# EAGLE schematic LEDSubMatrixHighDensity_temp (EAGLE 9.6.2)
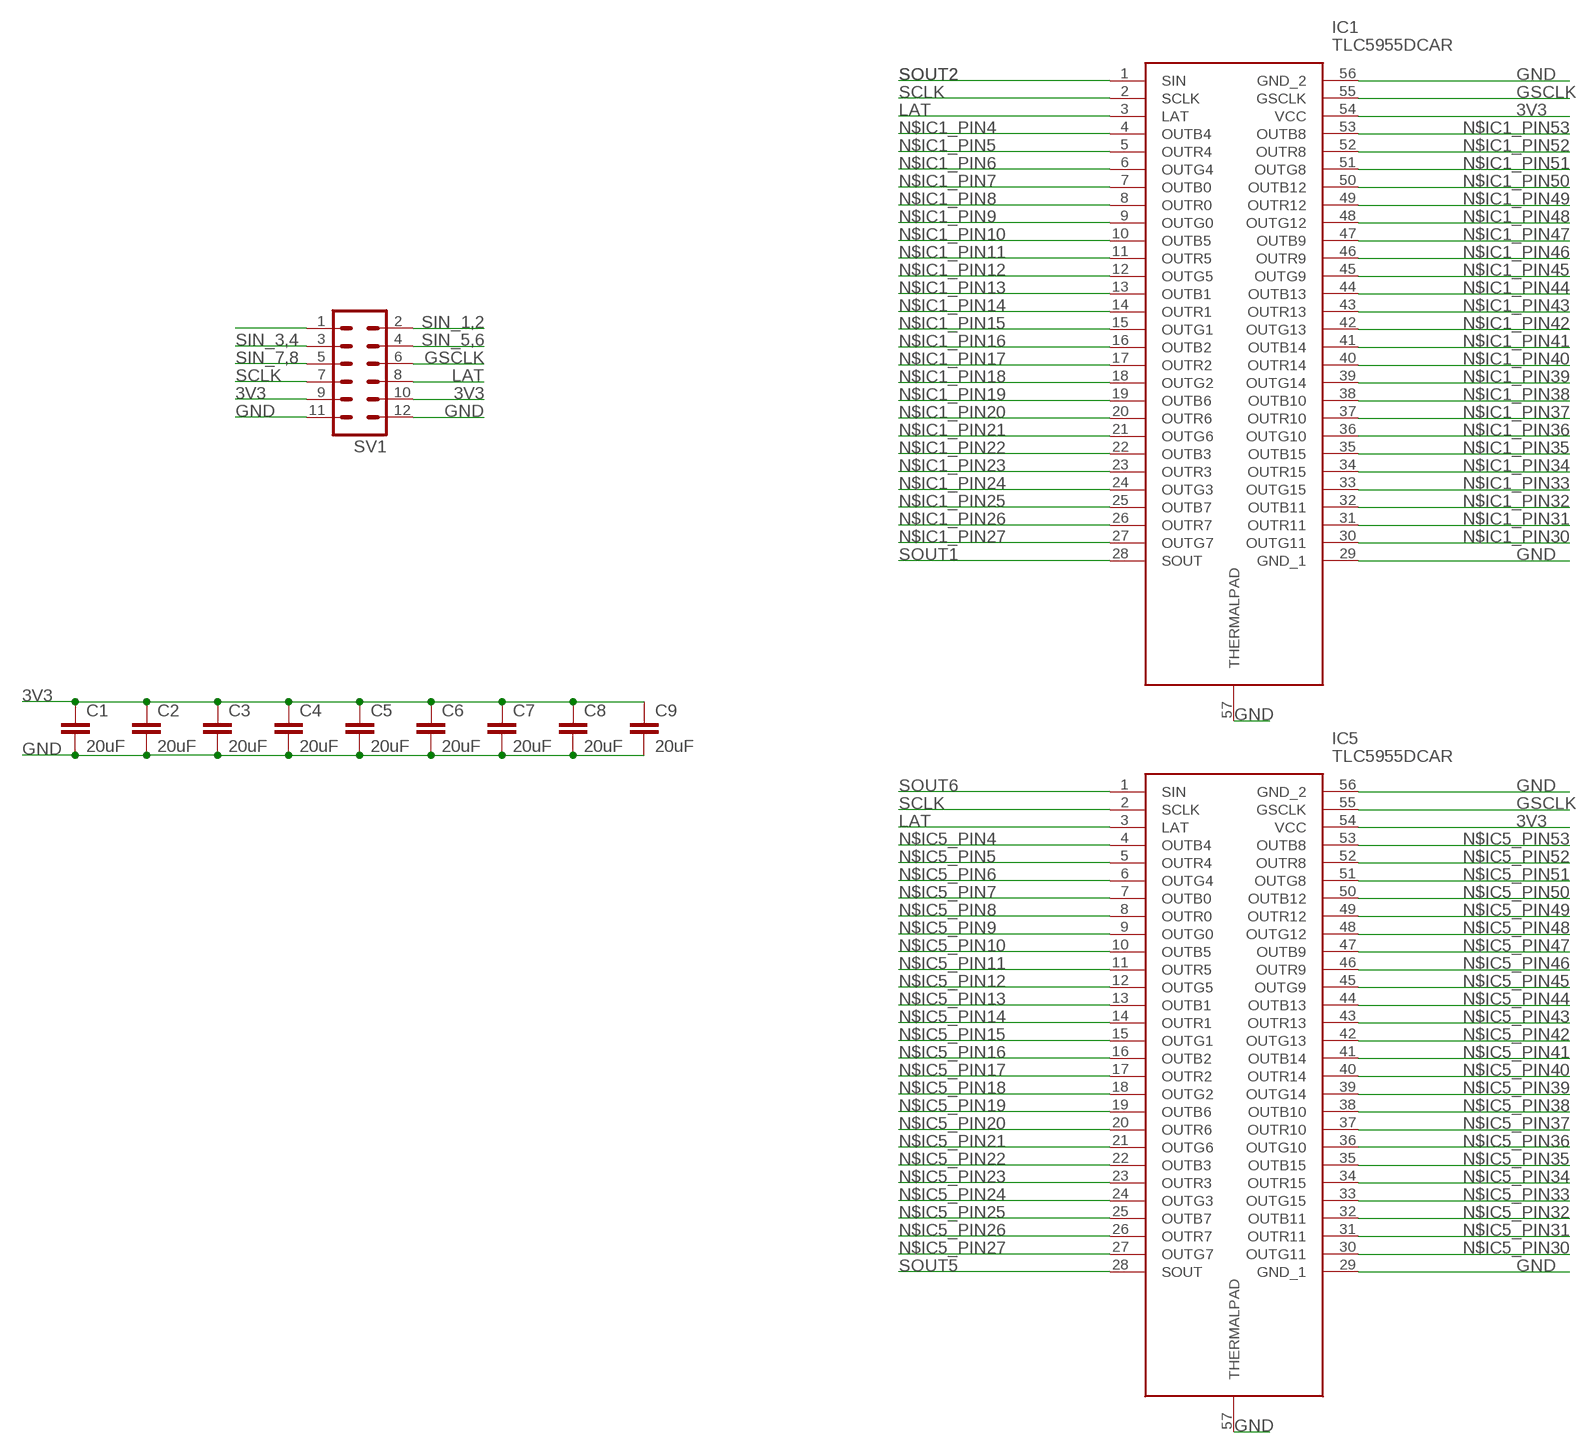
[diagram p0: schematic, sheet 1, part 1 of 2]
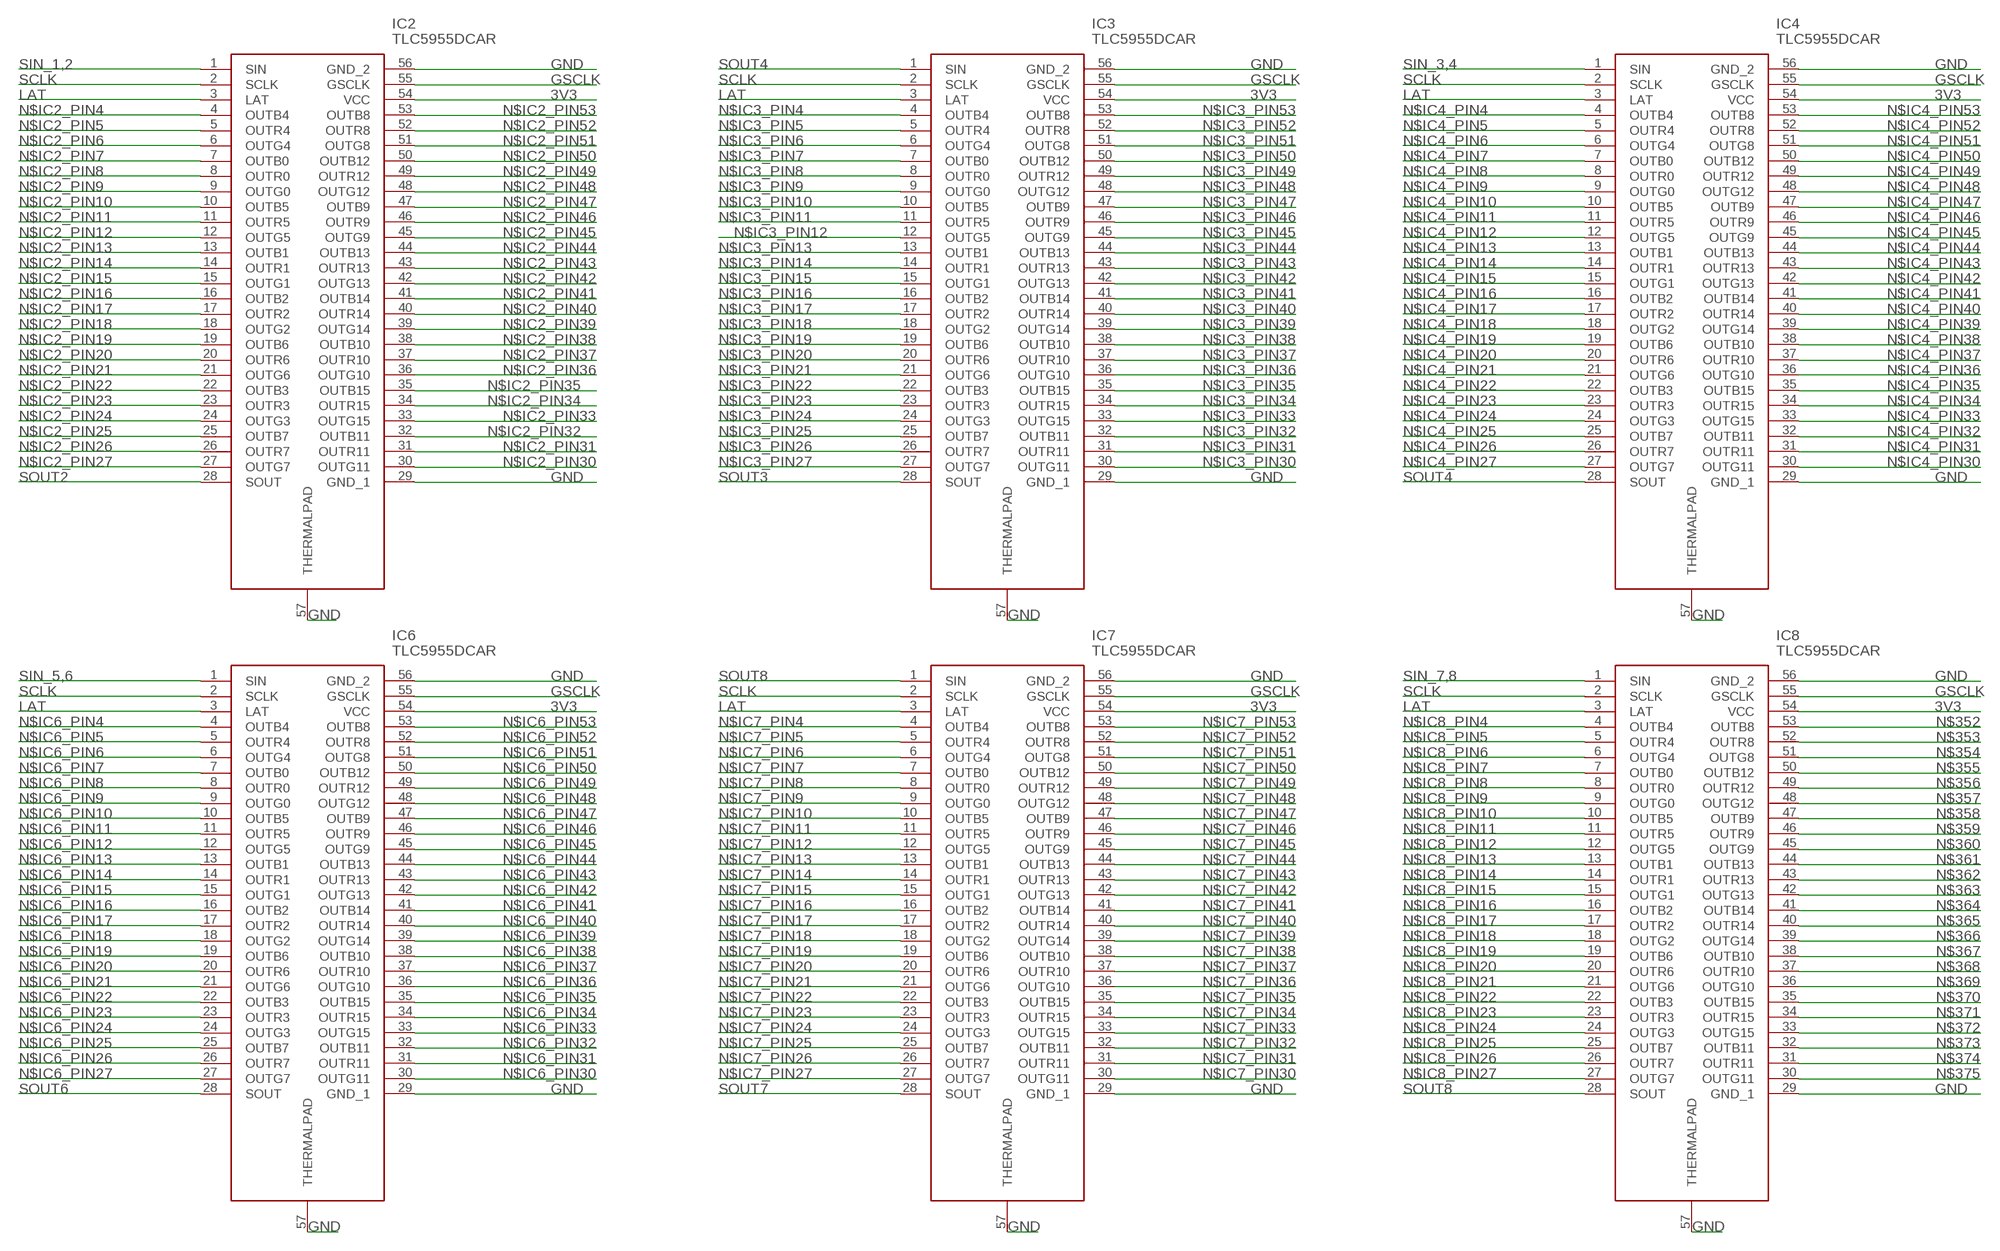
[diagram p1: schematic, sheet 1, part 2 of 2]

## Parts
C1  20uF  C-EUC0603  [C0603]
C2  20uF  C-EUC0603  [C0603]
C3  20uF  C-EUC0603  [C0603]
C4  20uF  C-EUC0603  [C0603]
C5  20uF  C-EUC0603  [C0603]
C6  20uF  C-EUC0603  [C0603]
C7  20uF  C-EUC0603  [C0603]
C8  20uF  C-EUC0603  [C0603]
C9  20uF  C-EUC0805  [C0805]
IC1  TLC5955DCAR  [SOP50P810X120-57N]
IC2  TLC5955DCAR  [SOP50P810X120-57N]
IC3  TLC5955DCAR  [SOP50P810X120-57N]
IC4  TLC5955DCAR  [SOP50P810X120-57N]
IC5  TLC5955DCAR  [SOP50P810X120-57N]
IC6  TLC5955DCAR  [SOP50P810X120-57N]
IC7  TLC5955DCAR  [SOP50P810X120-57N]
IC8  TLC5955DCAR  [SOP50P810X120-57N]
SV1  MA06-2  [MA06-2]

## Nets
3V3: C1.1 C2.1 C3.1 C4.1 C5.1 C6.1 C7.1 C8.1 C9.1 IC1.54(VCC) IC2.54(VCC) IC3.54(VCC) IC4.54(VCC) IC5.54(VCC) IC6.54(VCC) IC7.54(VCC) IC8.54(VCC) SV1.9 SV1.10
GND: C1.2 C2.2 C3.2 C4.2 C5.2 C6.2 C7.2 C8.2 C9.2 IC1.29(GND_1) IC1.56(GND_2) IC1.57(THERMALPAD) IC2.29(GND_1) IC2.56(GND_2) IC2.57(THERMALPAD) IC3.29(GND_1) IC3.56(GND_2) IC3.57(THERMALPAD) IC4.29(GND_1) IC4.56(GND_2) IC4.57(THERMALPAD) IC5.29(GND_1) IC5.56(GND_2) IC5.57(THERMALPAD) IC6.29(GND_1) IC6.56(GND_2) IC6.57(THERMALPAD) IC7.29(GND_1) IC7.56(GND_2) IC7.57(THERMALPAD) IC8.29(GND_1) IC8.56(GND_2) IC8.57(THERMALPAD) SV1.11 SV1.12
GSCLK: IC1.55(GSCLK) IC2.55(GSCLK) IC3.55(GSCLK) IC4.55(GSCLK) IC5.55(GSCLK) IC6.55(GSCLK) IC7.55(GSCLK) IC8.55(GSCLK) SV1.6
LAT: IC1.3(LAT) IC2.3(LAT) IC3.3(LAT) IC4.3(LAT) IC5.3(LAT) IC6.3(LAT) IC7.3(LAT) IC8.3(LAT) SV1.8
N$1: SV1.1
N$352: IC8.53(OUTB8)
N$353: IC8.52(OUTR8)
N$354: IC8.51(OUTG8)
N$355: IC8.50(OUTB12)
N$356: IC8.49(OUTR12)
N$357: IC8.48(OUTG12)
N$358: IC8.47(OUTB9)
N$359: IC8.46(OUTR9)
N$360: IC8.45(OUTG9)
N$361: IC8.44(OUTB13)
N$362: IC8.43(OUTR13)
N$363: IC8.42(OUTG13)
N$364: IC8.41(OUTB14)
N$365: IC8.40(OUTR14)
N$366: IC8.39(OUTG14)
N$367: IC8.38(OUTB10)
N$368: IC8.37(OUTR10)
N$369: IC8.36(OUTG10)
N$370: IC8.35(OUTB15)
N$371: IC8.34(OUTR15)
N$372: IC8.33(OUTG15)
N$373: IC8.32(OUTB11)
N$374: IC8.31(OUTR11)
N$375: IC8.30(OUTG11)
N$IC1_PIN4: IC1.4(OUTB4)
N$IC1_PIN5: IC1.5(OUTR4)
N$IC1_PIN6: IC1.6(OUTG4)
N$IC1_PIN7: IC1.7(OUTB0)
N$IC1_PIN8: IC1.8(OUTR0)
N$IC1_PIN9: IC1.9(OUTG0)
N$IC1_PIN10: IC1.10(OUTB5)
N$IC1_PIN11: IC1.11(OUTR5)
N$IC1_PIN12: IC1.12(OUTG5)
N$IC1_PIN13: IC1.13(OUTB1)
N$IC1_PIN14: IC1.14(OUTR1)
N$IC1_PIN15: IC1.15(OUTG1)
N$IC1_PIN16: IC1.16(OUTB2)
N$IC1_PIN17: IC1.17(OUTR2)
N$IC1_PIN18: IC1.18(OUTG2)
N$IC1_PIN19: IC1.19(OUTB6)
N$IC1_PIN20: IC1.20(OUTR6)
N$IC1_PIN21: IC1.21(OUTG6)
N$IC1_PIN22: IC1.22(OUTB3)
N$IC1_PIN23: IC1.23(OUTR3)
N$IC1_PIN24: IC1.24(OUTG3)
N$IC1_PIN25: IC1.25(OUTB7)
N$IC1_PIN26: IC1.26(OUTR7)
N$IC1_PIN27: IC1.27(OUTG7)
N$IC1_PIN30: IC1.30(OUTG11)
N$IC1_PIN31: IC1.31(OUTR11)
N$IC1_PIN32: IC1.32(OUTB11)
N$IC1_PIN33: IC1.33(OUTG15)
N$IC1_PIN34: IC1.34(OUTR15)
N$IC1_PIN35: IC1.35(OUTB15)
N$IC1_PIN36: IC1.36(OUTG10)
N$IC1_PIN37: IC1.37(OUTR10)
N$IC1_PIN38: IC1.38(OUTB10)
N$IC1_PIN39: IC1.39(OUTG14)
N$IC1_PIN40: IC1.40(OUTR14)
N$IC1_PIN41: IC1.41(OUTB14)
N$IC1_PIN42: IC1.42(OUTG13)
N$IC1_PIN43: IC1.43(OUTR13)
N$IC1_PIN44: IC1.44(OUTB13)
N$IC1_PIN45: IC1.45(OUTG9)
N$IC1_PIN46: IC1.46(OUTR9)
N$IC1_PIN47: IC1.47(OUTB9)
N$IC1_PIN48: IC1.48(OUTG12)
N$IC1_PIN49: IC1.49(OUTR12)
N$IC1_PIN50: IC1.50(OUTB12)
N$IC1_PIN51: IC1.51(OUTG8)
N$IC1_PIN52: IC1.52(OUTR8)
N$IC1_PIN53: IC1.53(OUTB8)
N$IC2_PIN4: IC2.4(OUTB4)
N$IC2_PIN5: IC2.5(OUTR4)
N$IC2_PIN6: IC2.6(OUTG4)
N$IC2_PIN7: IC2.7(OUTB0)
N$IC2_PIN8: IC2.8(OUTR0)
N$IC2_PIN9: IC2.9(OUTG0)
N$IC2_PIN10: IC2.10(OUTB5)
N$IC2_PIN11: IC2.11(OUTR5)
N$IC2_PIN12: IC2.12(OUTG5)
N$IC2_PIN13: IC2.13(OUTB1)
N$IC2_PIN14: IC2.14(OUTR1)
N$IC2_PIN15: IC2.15(OUTG1)
N$IC2_PIN16: IC2.16(OUTB2)
N$IC2_PIN17: IC2.17(OUTR2)
N$IC2_PIN18: IC2.18(OUTG2)
N$IC2_PIN19: IC2.19(OUTB6)
N$IC2_PIN20: IC2.20(OUTR6)
N$IC2_PIN21: IC2.21(OUTG6)
N$IC2_PIN22: IC2.22(OUTB3)
N$IC2_PIN23: IC2.23(OUTR3)
N$IC2_PIN24: IC2.24(OUTG3)
N$IC2_PIN25: IC2.25(OUTB7)
N$IC2_PIN26: IC2.26(OUTR7)
N$IC2_PIN27: IC2.27(OUTG7)
N$IC2_PIN30: IC2.30(OUTG11)
N$IC2_PIN31: IC2.31(OUTR11)
N$IC2_PIN32: IC2.32(OUTB11)
N$IC2_PIN33: IC2.33(OUTG15)
N$IC2_PIN34: IC2.34(OUTR15)
N$IC2_PIN35: IC2.35(OUTB15)
N$IC2_PIN36: IC2.36(OUTG10)
N$IC2_PIN37: IC2.37(OUTR10)
N$IC2_PIN38: IC2.38(OUTB10)
N$IC2_PIN39: IC2.39(OUTG14)
N$IC2_PIN40: IC2.40(OUTR14)
N$IC2_PIN41: IC2.41(OUTB14)
N$IC2_PIN42: IC2.42(OUTG13)
N$IC2_PIN43: IC2.43(OUTR13)
N$IC2_PIN44: IC2.44(OUTB13)
N$IC2_PIN45: IC2.45(OUTG9)
N$IC2_PIN46: IC2.46(OUTR9)
N$IC2_PIN47: IC2.47(OUTB9)
N$IC2_PIN48: IC2.48(OUTG12)
N$IC2_PIN49: IC2.49(OUTR12)
N$IC2_PIN50: IC2.50(OUTB12)
N$IC2_PIN51: IC2.51(OUTG8)
N$IC2_PIN52: IC2.52(OUTR8)
N$IC2_PIN53: IC2.53(OUTB8)
N$IC3_PIN4: IC3.4(OUTB4)
N$IC3_PIN5: IC3.5(OUTR4)
N$IC3_PIN6: IC3.6(OUTG4)
N$IC3_PIN7: IC3.7(OUTB0)
N$IC3_PIN8: IC3.8(OUTR0)
N$IC3_PIN9: IC3.9(OUTG0)
N$IC3_PIN10: IC3.10(OUTB5)
N$IC3_PIN11: IC3.11(OUTR5)
N$IC3_PIN12: IC3.12(OUTG5)
N$IC3_PIN13: IC3.13(OUTB1)
N$IC3_PIN14: IC3.14(OUTR1)
N$IC3_PIN15: IC3.15(OUTG1)
N$IC3_PIN16: IC3.16(OUTB2)
N$IC3_PIN17: IC3.17(OUTR2)
N$IC3_PIN18: IC3.18(OUTG2)
N$IC3_PIN19: IC3.19(OUTB6)
N$IC3_PIN20: IC3.20(OUTR6)
N$IC3_PIN21: IC3.21(OUTG6)
N$IC3_PIN22: IC3.22(OUTB3)
N$IC3_PIN23: IC3.23(OUTR3)
N$IC3_PIN24: IC3.24(OUTG3)
N$IC3_PIN25: IC3.25(OUTB7)
N$IC3_PIN26: IC3.26(OUTR7)
N$IC3_PIN27: IC3.27(OUTG7)
N$IC3_PIN30: IC3.30(OUTG11)
N$IC3_PIN31: IC3.31(OUTR11)
N$IC3_PIN32: IC3.32(OUTB11)
N$IC3_PIN33: IC3.33(OUTG15)
N$IC3_PIN34: IC3.34(OUTR15)
N$IC3_PIN35: IC3.35(OUTB15)
N$IC3_PIN36: IC3.36(OUTG10)
N$IC3_PIN37: IC3.37(OUTR10)
N$IC3_PIN38: IC3.38(OUTB10)
N$IC3_PIN39: IC3.39(OUTG14)
N$IC3_PIN40: IC3.40(OUTR14)
N$IC3_PIN41: IC3.41(OUTB14)
N$IC3_PIN42: IC3.42(OUTG13)
N$IC3_PIN43: IC3.43(OUTR13)
N$IC3_PIN44: IC3.44(OUTB13)
N$IC3_PIN45: IC3.45(OUTG9)
N$IC3_PIN46: IC3.46(OUTR9)
N$IC3_PIN47: IC3.47(OUTB9)
N$IC3_PIN48: IC3.48(OUTG12)
N$IC3_PIN49: IC3.49(OUTR12)
N$IC3_PIN50: IC3.50(OUTB12)
N$IC3_PIN51: IC3.51(OUTG8)
N$IC3_PIN52: IC3.52(OUTR8)
N$IC3_PIN53: IC3.53(OUTB8)
N$IC4_PIN4: IC4.4(OUTB4)
N$IC4_PIN5: IC4.5(OUTR4)
N$IC4_PIN6: IC4.6(OUTG4)
N$IC4_PIN7: IC4.7(OUTB0)
N$IC4_PIN8: IC4.8(OUTR0)
N$IC4_PIN9: IC4.9(OUTG0)
N$IC4_PIN10: IC4.10(OUTB5)
N$IC4_PIN11: IC4.11(OUTR5)
N$IC4_PIN12: IC4.12(OUTG5)
N$IC4_PIN13: IC4.13(OUTB1)
N$IC4_PIN14: IC4.14(OUTR1)
N$IC4_PIN15: IC4.15(OUTG1)
N$IC4_PIN16: IC4.16(OUTB2)
N$IC4_PIN17: IC4.17(OUTR2)
N$IC4_PIN18: IC4.18(OUTG2)
N$IC4_PIN19: IC4.19(OUTB6)
N$IC4_PIN20: IC4.20(OUTR6)
N$IC4_PIN21: IC4.21(OUTG6)
N$IC4_PIN22: IC4.22(OUTB3)
N$IC4_PIN23: IC4.23(OUTR3)
N$IC4_PIN24: IC4.24(OUTG3)
N$IC4_PIN25: IC4.25(OUTB7)
N$IC4_PIN26: IC4.26(OUTR7)
N$IC4_PIN27: IC4.27(OUTG7)
N$IC4_PIN30: IC4.30(OUTG11)
N$IC4_PIN31: IC4.31(OUTR11)
N$IC4_PIN32: IC4.32(OUTB11)
N$IC4_PIN33: IC4.33(OUTG15)
N$IC4_PIN34: IC4.34(OUTR15)
N$IC4_PIN35: IC4.35(OUTB15)
N$IC4_PIN36: IC4.36(OUTG10)
N$IC4_PIN37: IC4.37(OUTR10)
N$IC4_PIN38: IC4.38(OUTB10)
N$IC4_PIN39: IC4.39(OUTG14)
N$IC4_PIN40: IC4.40(OUTR14)
N$IC4_PIN41: IC4.41(OUTB14)
N$IC4_PIN42: IC4.42(OUTG13)
N$IC4_PIN43: IC4.43(OUTR13)
N$IC4_PIN44: IC4.44(OUTB13)
N$IC4_PIN45: IC4.45(OUTG9)
N$IC4_PIN46: IC4.46(OUTR9)
N$IC4_PIN47: IC4.47(OUTB9)
N$IC4_PIN48: IC4.48(OUTG12)
N$IC4_PIN49: IC4.49(OUTR12)
N$IC4_PIN50: IC4.50(OUTB12)
N$IC4_PIN51: IC4.51(OUTG8)
N$IC4_PIN52: IC4.52(OUTR8)
N$IC4_PIN53: IC4.53(OUTB8)
N$IC5_PIN4: IC5.4(OUTB4)
N$IC5_PIN5: IC5.5(OUTR4)
N$IC5_PIN6: IC5.6(OUTG4)
N$IC5_PIN7: IC5.7(OUTB0)
N$IC5_PIN8: IC5.8(OUTR0)
N$IC5_PIN9: IC5.9(OUTG0)
N$IC5_PIN10: IC5.10(OUTB5)
N$IC5_PIN11: IC5.11(OUTR5)
N$IC5_PIN12: IC5.12(OUTG5)
N$IC5_PIN13: IC5.13(OUTB1)
N$IC5_PIN14: IC5.14(OUTR1)
N$IC5_PIN15: IC5.15(OUTG1)
N$IC5_PIN16: IC5.16(OUTB2)
N$IC5_PIN17: IC5.17(OUTR2)
N$IC5_PIN18: IC5.18(OUTG2)
N$IC5_PIN19: IC5.19(OUTB6)
N$IC5_PIN20: IC5.20(OUTR6)
N$IC5_PIN21: IC5.21(OUTG6)
N$IC5_PIN22: IC5.22(OUTB3)
N$IC5_PIN23: IC5.23(OUTR3)
N$IC5_PIN24: IC5.24(OUTG3)
N$IC5_PIN25: IC5.25(OUTB7)
N$IC5_PIN26: IC5.26(OUTR7)
N$IC5_PIN27: IC5.27(OUTG7)
N$IC5_PIN30: IC5.30(OUTG11)
N$IC5_PIN31: IC5.31(OUTR11)
N$IC5_PIN32: IC5.32(OUTB11)
N$IC5_PIN33: IC5.33(OUTG15)
N$IC5_PIN34: IC5.34(OUTR15)
N$IC5_PIN35: IC5.35(OUTB15)
N$IC5_PIN36: IC5.36(OUTG10)
N$IC5_PIN37: IC5.37(OUTR10)
N$IC5_PIN38: IC5.38(OUTB10)
N$IC5_PIN39: IC5.39(OUTG14)
N$IC5_PIN40: IC5.40(OUTR14)
N$IC5_PIN41: IC5.41(OUTB14)
N$IC5_PIN42: IC5.42(OUTG13)
N$IC5_PIN43: IC5.43(OUTR13)
N$IC5_PIN44: IC5.44(OUTB13)
N$IC5_PIN45: IC5.45(OUTG9)
N$IC5_PIN46: IC5.46(OUTR9)
N$IC5_PIN47: IC5.47(OUTB9)
N$IC5_PIN48: IC5.48(OUTG12)
N$IC5_PIN49: IC5.49(OUTR12)
N$IC5_PIN50: IC5.50(OUTB12)
N$IC5_PIN51: IC5.51(OUTG8)
N$IC5_PIN52: IC5.52(OUTR8)
N$IC5_PIN53: IC5.53(OUTB8)
N$IC6_PIN4: IC6.4(OUTB4)
N$IC6_PIN5: IC6.5(OUTR4)
N$IC6_PIN6: IC6.6(OUTG4)
N$IC6_PIN7: IC6.7(OUTB0)
N$IC6_PIN8: IC6.8(OUTR0)
N$IC6_PIN9: IC6.9(OUTG0)
N$IC6_PIN10: IC6.10(OUTB5)
N$IC6_PIN11: IC6.11(OUTR5)
N$IC6_PIN12: IC6.12(OUTG5)
N$IC6_PIN13: IC6.13(OUTB1)
N$IC6_PIN14: IC6.14(OUTR1)
N$IC6_PIN15: IC6.15(OUTG1)
N$IC6_PIN16: IC6.16(OUTB2)
N$IC6_PIN17: IC6.17(OUTR2)
N$IC6_PIN18: IC6.18(OUTG2)
N$IC6_PIN19: IC6.19(OUTB6)
N$IC6_PIN20: IC6.20(OUTR6)
N$IC6_PIN21: IC6.21(OUTG6)
N$IC6_PIN22: IC6.22(OUTB3)
N$IC6_PIN23: IC6.23(OUTR3)
N$IC6_PIN24: IC6.24(OUTG3)
N$IC6_PIN25: IC6.25(OUTB7)
N$IC6_PIN26: IC6.26(OUTR7)
N$IC6_PIN27: IC6.27(OUTG7)
N$IC6_PIN30: IC6.30(OUTG11)
N$IC6_PIN31: IC6.31(OUTR11)
N$IC6_PIN32: IC6.32(OUTB11)
N$IC6_PIN33: IC6.33(OUTG15)
N$IC6_PIN34: IC6.34(OUTR15)
N$IC6_PIN35: IC6.35(OUTB15)
N$IC6_PIN36: IC6.36(OUTG10)
N$IC6_PIN37: IC6.37(OUTR10)
N$IC6_PIN38: IC6.38(OUTB10)
N$IC6_PIN39: IC6.39(OUTG14)
N$IC6_PIN40: IC6.40(OUTR14)
N$IC6_PIN41: IC6.41(OUTB14)
N$IC6_PIN42: IC6.42(OUTG13)
N$IC6_PIN43: IC6.43(OUTR13)
N$IC6_PIN44: IC6.44(OUTB13)
N$IC6_PIN45: IC6.45(OUTG9)
N$IC6_PIN46: IC6.46(OUTR9)
N$IC6_PIN47: IC6.47(OUTB9)
N$IC6_PIN48: IC6.48(OUTG12)
N$IC6_PIN49: IC6.49(OUTR12)
N$IC6_PIN50: IC6.50(OUTB12)
N$IC6_PIN51: IC6.51(OUTG8)
N$IC6_PIN52: IC6.52(OUTR8)
N$IC6_PIN53: IC6.53(OUTB8)
N$IC7_PIN4: IC7.4(OUTB4)
N$IC7_PIN5: IC7.5(OUTR4)
N$IC7_PIN6: IC7.6(OUTG4)
N$IC7_PIN7: IC7.7(OUTB0)
N$IC7_PIN8: IC7.8(OUTR0)
N$IC7_PIN9: IC7.9(OUTG0)
N$IC7_PIN10: IC7.10(OUTB5)
N$IC7_PIN11: IC7.11(OUTR5)
N$IC7_PIN12: IC7.12(OUTG5)
N$IC7_PIN13: IC7.13(OUTB1)
N$IC7_PIN14: IC7.14(OUTR1)
N$IC7_PIN15: IC7.15(OUTG1)
N$IC7_PIN16: IC7.16(OUTB2)
N$IC7_PIN17: IC7.17(OUTR2)
N$IC7_PIN18: IC7.18(OUTG2)
N$IC7_PIN19: IC7.19(OUTB6)
N$IC7_PIN20: IC7.20(OUTR6)
N$IC7_PIN21: IC7.21(OUTG6)
N$IC7_PIN22: IC7.22(OUTB3)
N$IC7_PIN23: IC7.23(OUTR3)
N$IC7_PIN24: IC7.24(OUTG3)
N$IC7_PIN25: IC7.25(OUTB7)
N$IC7_PIN26: IC7.26(OUTR7)
N$IC7_PIN27: IC7.27(OUTG7)
N$IC7_PIN30: IC7.30(OUTG11)
N$IC7_PIN31: IC7.31(OUTR11)
N$IC7_PIN32: IC7.32(OUTB11)
N$IC7_PIN33: IC7.33(OUTG15)
N$IC7_PIN34: IC7.34(OUTR15)
N$IC7_PIN35: IC7.35(OUTB15)
N$IC7_PIN36: IC7.36(OUTG10)
N$IC7_PIN37: IC7.37(OUTR10)
N$IC7_PIN38: IC7.38(OUTB10)
N$IC7_PIN39: IC7.39(OUTG14)
N$IC7_PIN40: IC7.40(OUTR14)
N$IC7_PIN41: IC7.41(OUTB14)
N$IC7_PIN42: IC7.42(OUTG13)
N$IC7_PIN43: IC7.43(OUTR13)
N$IC7_PIN44: IC7.44(OUTB13)
N$IC7_PIN45: IC7.45(OUTG9)
N$IC7_PIN46: IC7.46(OUTR9)
N$IC7_PIN47: IC7.47(OUTB9)
N$IC7_PIN48: IC7.48(OUTG12)
N$IC7_PIN49: IC7.49(OUTR12)
N$IC7_PIN50: IC7.50(OUTB12)
N$IC7_PIN51: IC7.51(OUTG8)
N$IC7_PIN52: IC7.52(OUTR8)
N$IC7_PIN53: IC7.53(OUTB8)
N$IC8_PIN4: IC8.4(OUTB4)
N$IC8_PIN5: IC8.5(OUTR4)
N$IC8_PIN6: IC8.6(OUTG4)
N$IC8_PIN7: IC8.7(OUTB0)
N$IC8_PIN8: IC8.8(OUTR0)
N$IC8_PIN9: IC8.9(OUTG0)
N$IC8_PIN10: IC8.10(OUTB5)
N$IC8_PIN11: IC8.11(OUTR5)
N$IC8_PIN12: IC8.12(OUTG5)
N$IC8_PIN13: IC8.13(OUTB1)
N$IC8_PIN14: IC8.14(OUTR1)
N$IC8_PIN15: IC8.15(OUTG1)
N$IC8_PIN16: IC8.16(OUTB2)
N$IC8_PIN17: IC8.17(OUTR2)
N$IC8_PIN18: IC8.18(OUTG2)
N$IC8_PIN19: IC8.19(OUTB6)
N$IC8_PIN20: IC8.20(OUTR6)
N$IC8_PIN21: IC8.21(OUTG6)
N$IC8_PIN22: IC8.22(OUTB3)
N$IC8_PIN23: IC8.23(OUTR3)
N$IC8_PIN24: IC8.24(OUTG3)
N$IC8_PIN25: IC8.25(OUTB7)
N$IC8_PIN26: IC8.26(OUTR7)
N$IC8_PIN27: IC8.27(OUTG7)
SCLK: IC1.2(SCLK) IC2.2(SCLK) IC3.2(SCLK) IC4.2(SCLK) IC5.2(SCLK) IC6.2(SCLK) IC7.2(SCLK) IC8.2(SCLK) SV1.7
SIN_1,2: IC2.1(SIN) SV1.2
SIN_3,4: IC4.1(SIN) SV1.3
SIN_5,6: IC6.1(SIN) SV1.4
SIN_7,8: IC8.1(SIN) SV1.5
SOUT1: IC1.28(SOUT)
SOUT2: IC1.1(SIN) IC2.28(SOUT)
SOUT3: IC3.28(SOUT)
SOUT4: IC3.1(SIN) IC4.28(SOUT)
SOUT5: IC5.28(SOUT)
SOUT6: IC5.1(SIN) IC6.28(SOUT)
SOUT7: IC7.28(SOUT)
SOUT8: IC7.1(SIN) IC8.28(SOUT)

## Library data of the parts
C1-C9 = rcl:C-EU: CAPACITOR, European symbol; SPICEPREFIX: C
IC1-IC8 = TLC5955DCAR:TLC5955DCAR: 48ch, 16bit PWM LED Driver with Dot-Correction, Brightness Control, Open/Short Detection Source: Datasheet <http://www.ti.com/lit/ds/symlink/tlc5955.pdf>; ARROW_PART_NUMBER: TLC5955DCAR; ARROW_PRICE-STOCK: https://www.arrow.com/en/products/tlc5955dcar/texas-instruments; DESCRIPTION: 48ch, 16bit PWM LED Driver with Dot-Correction, Brightness Control, Open/Short Detection; HEIGHT: 1.2mm; MANUFACTURER_NAME: Texas Instruments; MANUFACTURER_PART_NUMBER: TLC5955DCAR; MOUSER_PART_NUMBER: 595-TLC5955DCAR; MOUSER_PRICE-STOCK: https://www.mouser.co.uk/ProductDetail/Texas-Instruments/TLC5955DCAR?qs=%2Fd%252BFzHvH4c3zo%2FeGYG5n7g%3D%3D
SV1 = con-lstb:MA06-2: PIN HEADER; OC_FARNELL: unknown; OC_NEWARK: unknown